# EAGLE schematic Electronica_4K1 (EAGLE 9.6.2)

## Sheet 1 of 5: Enemy sensors connectors
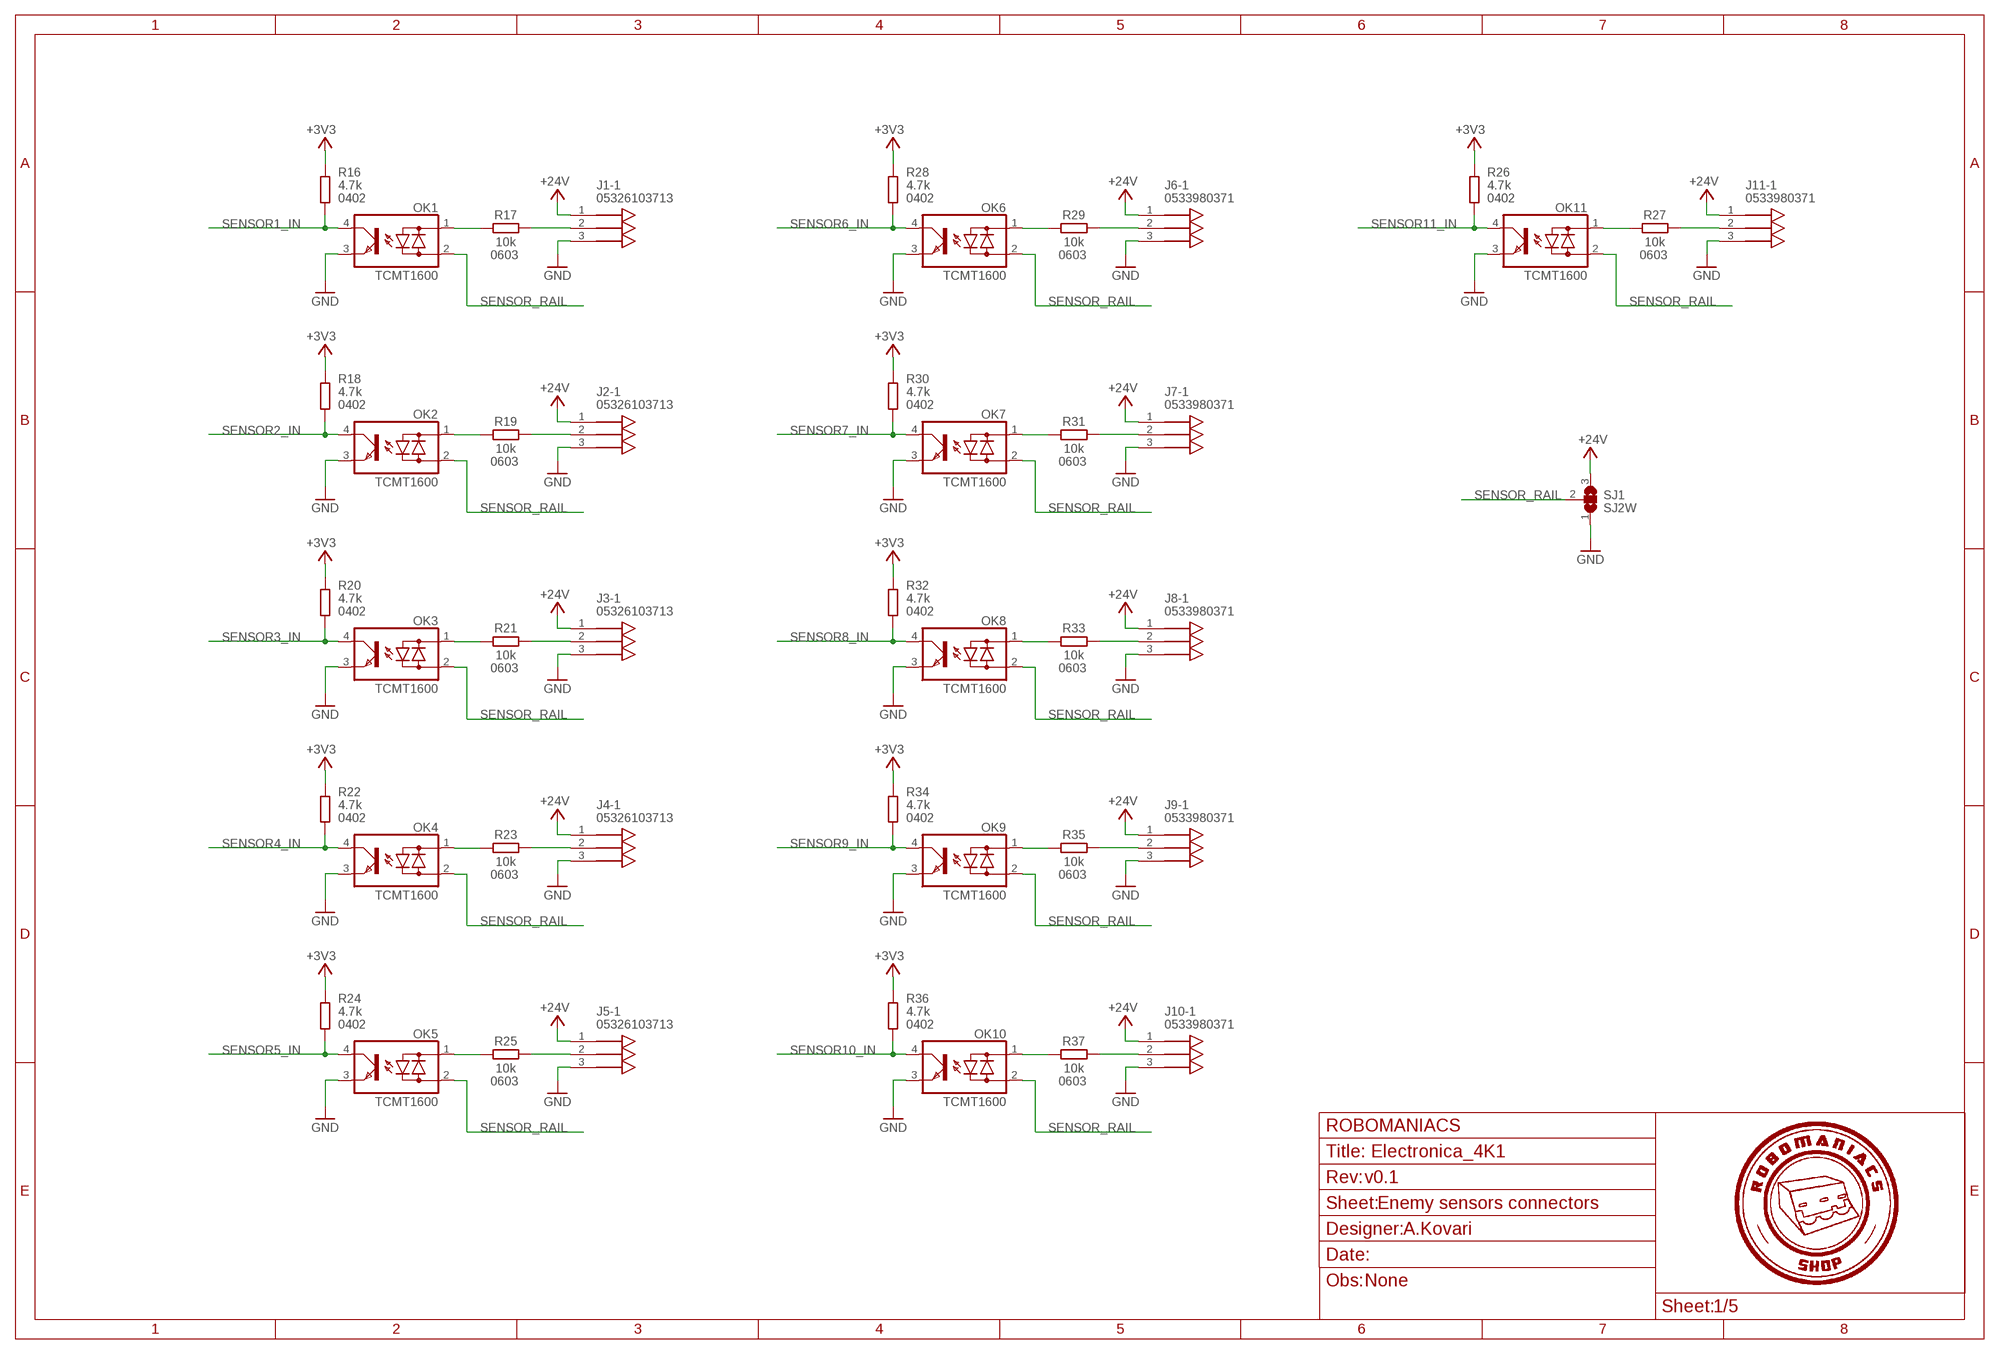
[diagram p0: schematic, sheet 1]
FRAME4 (_SCH_FRAME_A3): DNAME: A.Kovari; OBS: None; REVNUM: v0.1

### Parts
J1  05326103713  [PICOBLADE53261-0371]
J2  05326103713  [PICOBLADE53261-0371]
J3  05326103713  [PICOBLADE53261-0371]
J4  05326103713  [PICOBLADE53261-0371]
J5  05326103713  [PICOBLADE53261-0371]
J6  0533980371  [PICOBLADE53398-0571]
J7  0533980371  [PICOBLADE53398-0571]
J8  0533980371  [PICOBLADE53398-0571]
J9  0533980371  [PICOBLADE53398-0571]
J10  0533980371  [PICOBLADE53398-0571]
J11  0533980371  [PICOBLADE53398-0571]
OK1  TCMT1600  [SOP-4]
OK2  TCMT1600  [SOP-4]
OK3  TCMT1600  [SOP-4]
OK4  TCMT1600  [SOP-4]
OK5  TCMT1600  [SOP-4]
OK6  TCMT1600  [SOP-4]
OK7  TCMT1600  [SOP-4]
OK8  TCMT1600  [SOP-4]
OK9  TCMT1600  [SOP-4]
OK10  TCMT1600  [SOP-4]
OK11  TCMT1600  [SOP-4]
R16  4.7k  R0402  [R0402_IPC]
R17  10k  R-EU_R0603  [R0603]
R18  4.7k  R0402  [R0402_IPC]
R19  10k  R-EU_R0603  [R0603]
R20  4.7k  R0402  [R0402_IPC]
R21  10k  R-EU_R0603  [R0603]
R22  4.7k  R0402  [R0402_IPC]
R23  10k  R-EU_R0603  [R0603]
R24  4.7k  R0402  [R0402_IPC]
R25  10k  R-EU_R0603  [R0603]
R26  4.7k  R0402  [R0402_IPC]
R27  10k  R-EU_R0603  [R0603]
R28  4.7k  R0402  [R0402_IPC]
R29  10k  R-EU_R0603  [R0603]
R30  4.7k  R0402  [R0402_IPC]
R31  10k  R-EU_R0603  [R0603]
R32  4.7k  R0402  [R0402_IPC]
R33  10k  R-EU_R0603  [R0603]
R34  4.7k  R0402  [R0402_IPC]
R35  10k  R-EU_R0603  [R0603]
R36  4.7k  R0402  [R0402_IPC]
R37  10k  R-EU_R0603  [R0603]
SJ1  SJ2W  [SJ2W_1X1.5_NO]

### Nets
+3V3: R16.1 R18.1 R20.1 R22.1 R24.1 R26.1 R28.1 R30.1 R32.1 R34.1 R36.1 ; also sheet 2,4,5
+24V: J1.1 J2.1 J3.1 J4.1 J5.1 J6.1 J7.1 J8.1 J9.1 J10.1 J11.1 SJ1.3 ; also sheet 3,4,5
GND: J1.3 J2.3 J3.3 J4.3 J5.3 J6.3 J7.3 J8.3 J9.3 J10.3 J11.3 OK1.3(E) OK2.3(E) OK3.3(E) OK4.3(E) OK5.3(E) OK6.3(E) OK7.3(E) OK8.3(E) OK9.3(E) OK10.3(E) OK11.3(E) SJ1.1 ; also sheet 2,3,4,5
N$25: J1.2 R17.2
N$26: J2.2 R19.2
N$27: OK1.1(AC1) R17.1
N$28: OK2.1(AC1) R19.1
N$29: J3.2 R21.2
N$30: OK3.1(AC1) R21.1
N$31: J4.2 R23.2
N$32: OK4.1(AC1) R23.1
N$33: J5.2 R25.2
N$34: OK5.1(AC1) R25.1
N$35: J11.2 R27.2
N$36: OK11.1(AC1) R27.1
N$37: J6.2 R29.2
N$38: OK6.1(AC1) R29.1
N$39: J7.2 R31.2
N$40: OK7.1(AC1) R31.1
N$41: J8.2 R33.2
N$42: OK8.1(AC1) R33.1
N$43: J9.2 R35.2
N$44: OK9.1(AC1) R35.1
N$45: J10.2 R37.2
N$46: OK10.1(AC1) R37.1
SENSOR1_IN: OK1.4(C) R16.2 ; also sheet 5
SENSOR2_IN: OK2.4(C) R18.2 ; also sheet 5
SENSOR3_IN: OK3.4(C) R20.2 ; also sheet 5
SENSOR4_IN: OK4.4(C) R22.2 ; also sheet 5
SENSOR5_IN: OK5.4(C) R24.2 ; also sheet 5
SENSOR6_IN: OK6.4(C) R28.2 ; also sheet 5
SENSOR7_IN: OK7.4(C) R30.2 ; also sheet 5
SENSOR8_IN: OK8.4(C) R32.2 ; also sheet 5
SENSOR9_IN: OK9.4(C) R34.2 ; also sheet 5
SENSOR10_IN: OK10.4(C) R36.2 ; also sheet 5
SENSOR11_IN: OK11.4(C) R26.2 ; also sheet 5
SENSOR_RAIL: OK1.2(AC2) OK2.2(AC2) OK3.2(AC2) OK4.2(AC2) OK5.2(AC2) OK6.2(AC2) OK7.2(AC2) OK8.2(AC2) OK9.2(AC2) OK10.2(AC2) OK11.2(AC2) SJ1.2

## Sheet 2 of 5: Line sensors connectors
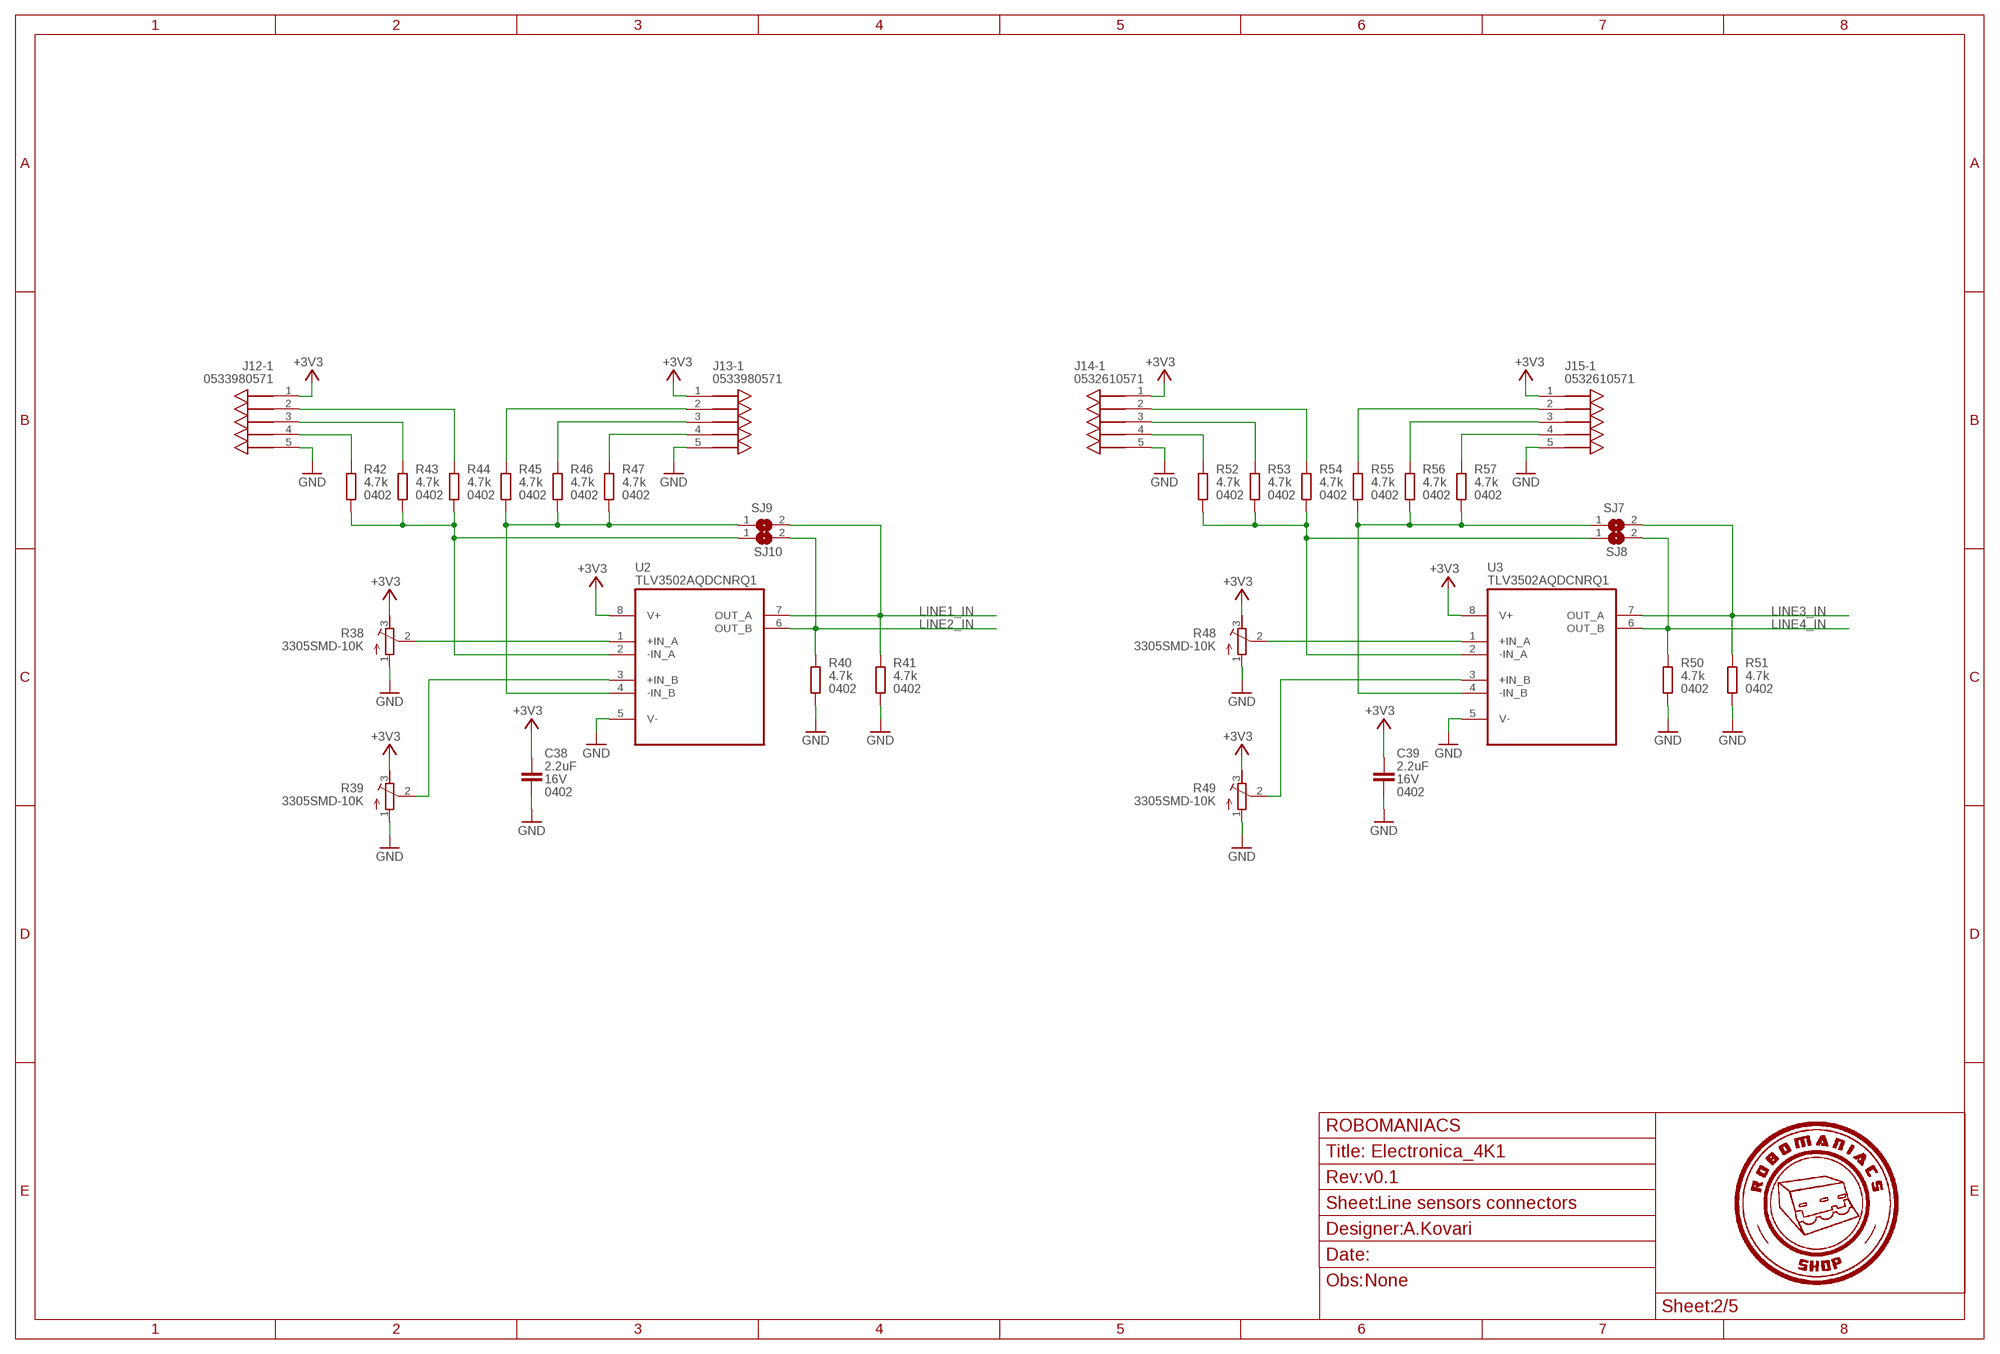
[diagram p1: schematic, sheet 2]
FRAME5 (_SCH_FRAME_A3): DNAME: A.Kovari; OBS: None; REVNUM: v0.1

### Parts
C38  2.2uF  C0402  [C0402_IPC]
C39  2.2uF  C0402  [C0402_IPC]
J12  0533980571  [PICOBLADE53398-0571]
J13  0533980571  [PICOBLADE53398-0571]
J14  0532610571  [PICOBLADE53261-0571]
J15  0532610571  [PICOBLADE53261-0571]
R38  3305SMD-10K  R-TRIMM3103  [RTRIM3103]
R39  3305SMD-10K  R-TRIMM3103  [RTRIM3103]
R40  4.7k  R0402  [R0402_IPC]
R41  4.7k  R0402  [R0402_IPC]
R42  4.7k  R0402  [R0402_IPC]
R43  4.7k  R0402  [R0402_IPC]
R44  4.7k  R0402  [R0402_IPC]
R45  4.7k  R0402  [R0402_IPC]
R46  4.7k  R0402  [R0402_IPC]
R47  4.7k  R0402  [R0402_IPC]
R48  3305SMD-10K  R-TRIMM3103  [RTRIM3103]
R49  3305SMD-10K  R-TRIMM3103  [RTRIM3103]
R50  4.7k  R0402  [R0402_IPC]
R51  4.7k  R0402  [R0402_IPC]
R52  4.7k  R0402  [R0402_IPC]
R53  4.7k  R0402  [R0402_IPC]
R54  4.7k  R0402  [R0402_IPC]
R55  4.7k  R0402  [R0402_IPC]
R56  4.7k  R0402  [R0402_IPC]
R57  4.7k  R0402  [R0402_IPC]
SJ7  SJ_1.5X1_NO  [SJ_1X1.5_NO]
SJ8  SJ_1.5X1_NO  [SJ_1X1.5_NO]
SJ9  SJ_1.5X1_NO  [SJ_1X1.5_NO]
SJ10  SJ_1.5X1_NO  [SJ_1X1.5_NO]
U2  TLV3502AQDCNRQ1  [SOT65P280X145-8N]
U3  TLV3502AQDCNRQ1  [SOT65P280X145-8N]

### Nets
+3V3: C38.1 C39.1 J12.1 J13.1 J14.1 J15.1 R38.3(E) R39.3(E) R48.3(E) R49.3(E) U2.8(V+) U3.8(V+) ; also sheet 1,4,5
GND: C38.2 C39.2 J12.5 J13.5 J14.5 J15.5 R38.1(A) R39.1(A) R40.2 R41.2 R48.1(A) R49.1(A) R50.2 R51.2 U2.5(V-) U3.5(V-) ; also sheet 1,3,4,5
LINE1_IN: R41.1 SJ9.2 U2.7(OUT_A) ; also sheet 5
LINE2_IN: R40.1 SJ10.2 U2.6(OUT_B) ; also sheet 5
LINE3_IN: R51.1 SJ7.2 U3.7(OUT_A) ; also sheet 5
LINE4_IN: R50.1 SJ8.2 U3.6(OUT_B) ; also sheet 5
N$47: R38.2(S) U2.1(+IN_A)
N$48: R39.2(S) U2.3(+IN_B)
N$49: R42.2 R43.2 R44.2 SJ10.1 U2.2(-IN_A)
N$50: R45.2 R46.2 R47.2 SJ9.1 U2.4(-IN_B)
N$51: J13.4 R47.1
N$52: J13.3 R46.1
N$53: J12.4 R42.1
N$54: J12.3 R43.1
N$55: J12.2 R44.1
N$56: J13.2 R45.1
N$57: R48.2(S) U3.1(+IN_A)
N$58: R49.2(S) U3.3(+IN_B)
N$59: R52.2 R53.2 R54.2 SJ8.1 U3.2(-IN_A)
N$60: R55.2 R56.2 R57.2 SJ7.1 U3.4(-IN_B)
N$61: J14.4 R52.1
N$62: J14.3 R53.1
N$63: J14.2 R54.1
N$64: J15.4 R57.1
N$65: J15.3 R56.1
N$66: J15.2 R55.1

## Sheet 3 of 5: +24V and +5V PSU
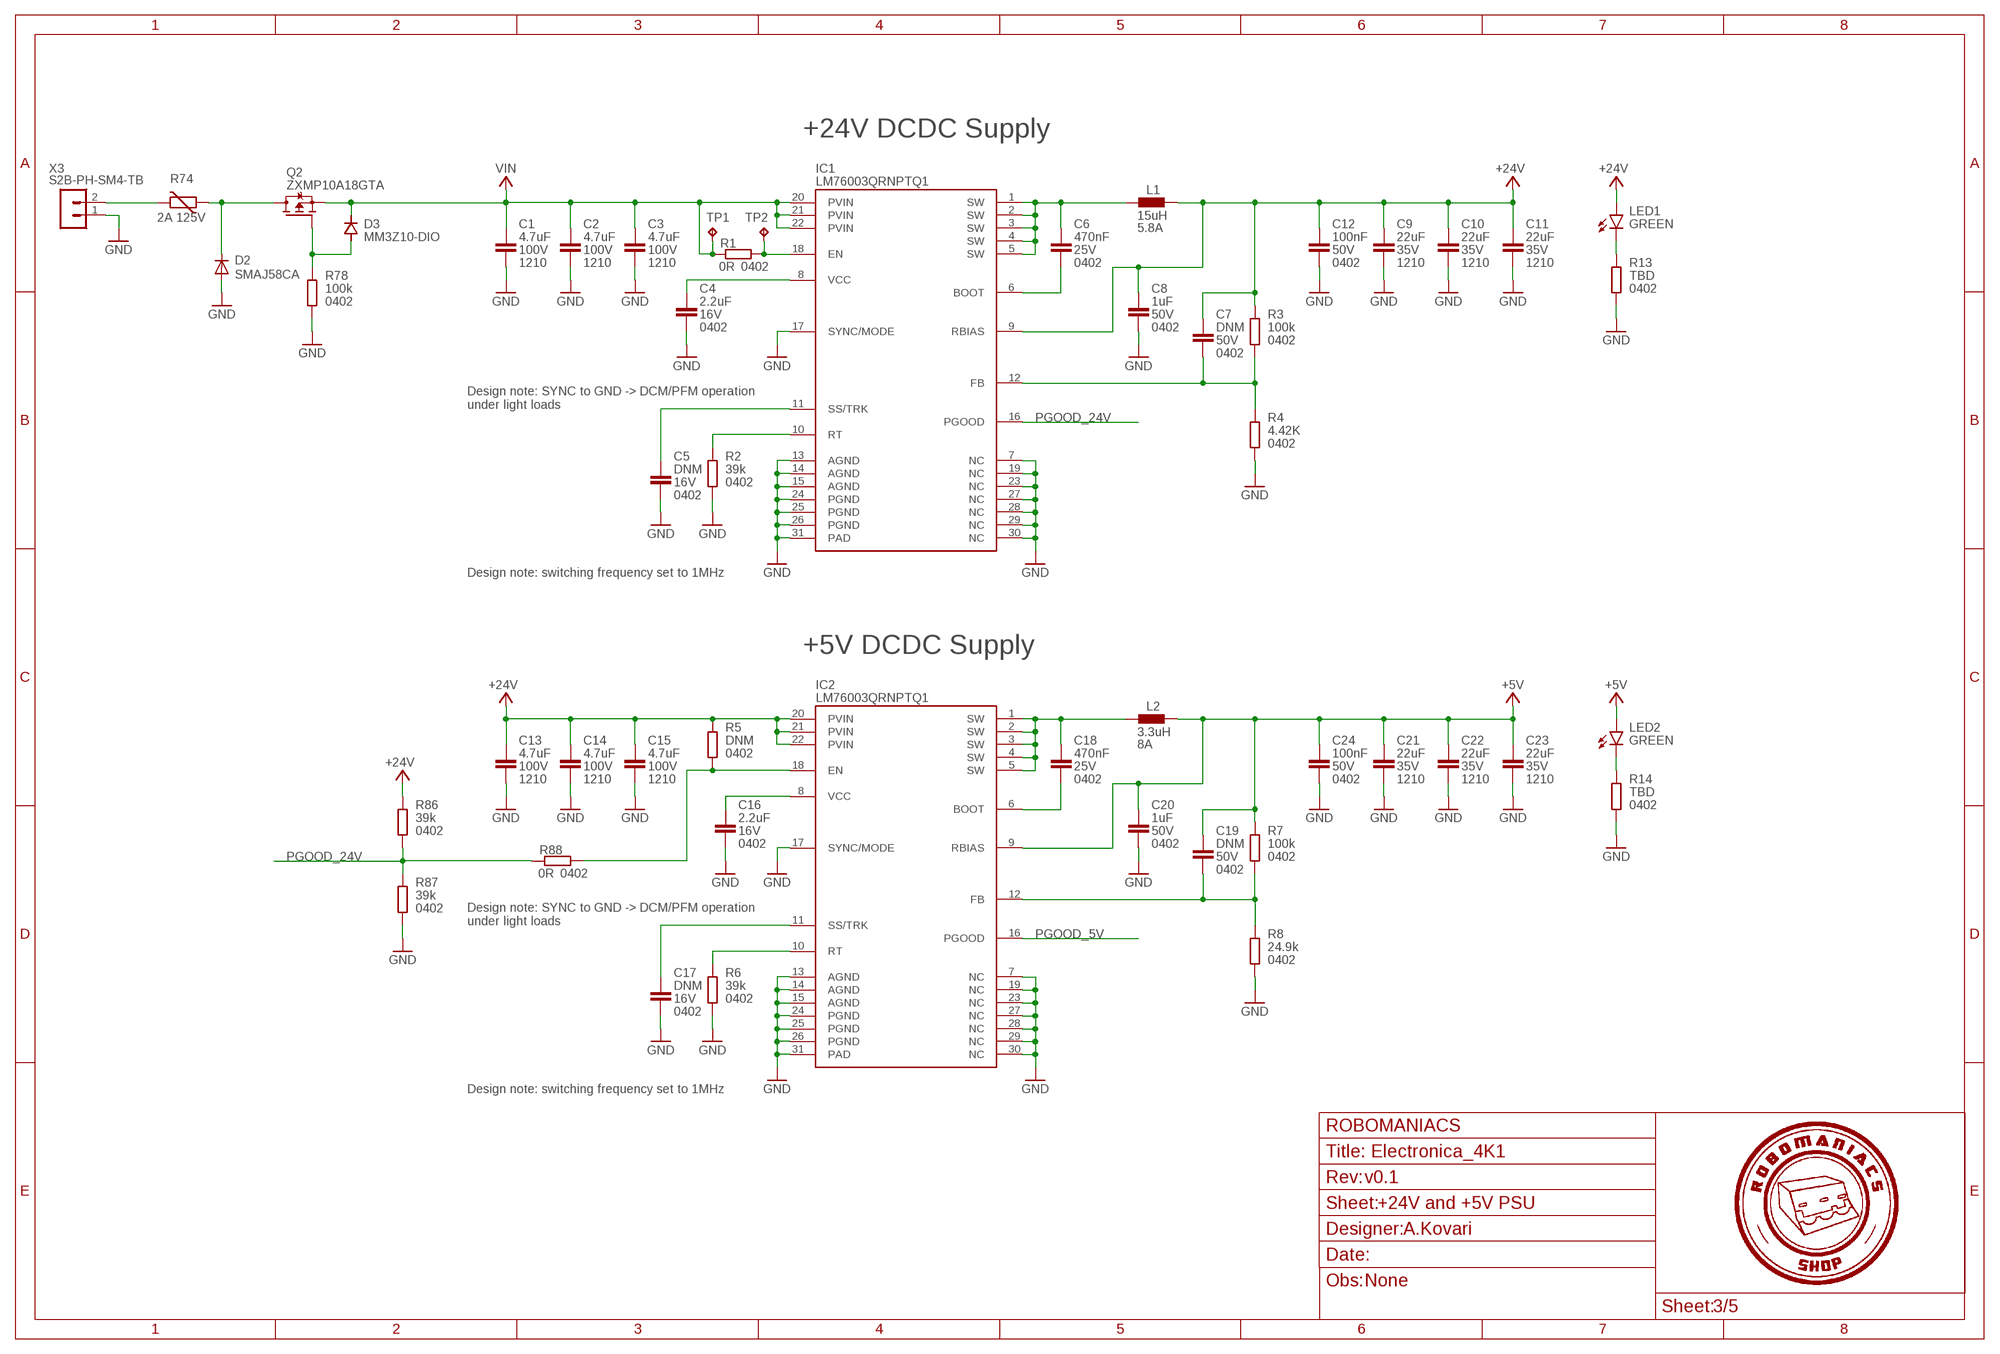
[diagram p2: schematic, sheet 3]
FRAME1 (_SCH_FRAME_A3): DNAME: A.Kovari; OBS: None; REVNUM: v0.1

### Parts
C1  4.7uF  C1210  [C1210]
C2  4.7uF  C1210  [C1210]
C3  4.7uF  C1210  [C1210]
C4  2.2uF  C0402  [C0402_IPC]
C5  DNM  C0402  [C0402_IPC]
C6  470nF  C0402  [C0402_IPC]
C7  DNM  C0402  [C0402_IPC]
C8  1uF  C0402  [C0402_IPC]
C9  22uF  C1210  [C1210]
C10  22uF  C1210  [C1210]
C11  22uF  C1210  [C1210]
C12  100nF  C0402  [C0402_IPC]
C13  4.7uF  C1210  [C1210]
C14  4.7uF  C1210  [C1210]
C15  4.7uF  C1210  [C1210]
C16  2.2uF  C0402  [C0402_IPC]
C17  DNM  C0402  [C0402_IPC]
C18  470nF  C0402  [C0402_IPC]
C19  DNM  C0402  [C0402_IPC]
C20  1uF  C0402  [C0402_IPC]
C21  22uF  C1210  [C1210]
C22  22uF  C1210  [C1210]
C23  22uF  C1210  [C1210]
C24  100nF  C0402  [C0402_IPC]
D2  SMAJ58CA  SMAJ33A  [SMA]
D3  MM3Z10-DIO  DSOD323  [SOD323]
IC1  LM76003QRNPTQ1  [WQFN30_6X4MM]
IC2  LM76003QRNPTQ1  [WQFN30_6X4MM]
L1  15uH  XAL6060  [XAL6060]
L2  3.3uH  XAL6060  [XAL6060]
LED1  GREEN  LED0603  [CHIPLED_0603]
LED2  GREEN  LED0603  [CHIPLED_0603]
Q2  ZXMP10A18GTA  BSP170P  [SOT223]
R1  0R  R0402  [R0402_IPC]
R2  39k  R0402  [R0402_IPC]
R3  100k  R0402  [R0402_IPC]
R4  4.42K  R0402  [R0402_IPC]
R5  DNM  R0402  [R0402_IPC]
R6  39k  R0402  [R0402_IPC]
R7  100k  R0402  [R0402_IPC]
R8  24.9k  R0402  [R0402_IPC]
R13  TBD  R0402  [R0402_IPC]
R14  TBD  R0402  [R0402_IPC]
R74  2A 125V  VARISTORCN1206  [CT/CN1206]
R78  100k  R0402  [R0402_IPC]
R86  39k  R0402  [R0402_IPC]
R87  39k  R0402  [R0402_IPC]
R88  0R  R0402  [R0402_IPC]
TP1  TPTP20SQ  [TP20SQ]
TP2  TPTP20SQ  [TP20SQ]
X3  S2B-PH-SM4-TB  [S2B-PH-SM4-TB]

### Nets
+5V: C19.1 C20.1 C21.1 C22.1 C23.1 C24.1 IC2.9(RBIAS) L2.2 LED2.A R7.2 ; also sheet 5
+24V: C7.1 C8.1 C9.1 C10.1 C11.1 C12.1 C13.1 C14.1 C15.1 IC1.9(RBIAS) IC2.20(PVIN) IC2.21(PVIN) IC2.22(PVIN) L1.2 LED1.A R3.2 R5.1 R86.2 ; also sheet 1,4,5
GND: C1.2 C2.2 C3.2 C4.2 C5.2 C8.2 C9.2 C10.2 C11.2 C12.2 C13.2 C14.2 C15.2 C16.2 C17.2 C20.2 C21.2 C22.2 C23.2 C24.2 D2.A IC1.7(NC) IC1.13(AGND) IC1.14(AGND) IC1.15(AGND) IC1.17(SYNC/MODE) IC1.19(NC) IC1.23(NC) IC1.24(PGND) IC1.25(PGND) IC1.26(PGND) IC1.27(NC) IC1.28(NC) IC1.29(NC) IC1.30(NC) IC1.31(PAD) IC2.7(NC) IC2.13(AGND) IC2.14(AGND) IC2.15(AGND) IC2.17(SYNC/MODE) IC2.19(NC) IC2.23(NC) IC2.24(PGND) IC2.25(PGND) IC2.26(PGND) IC2.27(NC) IC2.28(NC) IC2.29(NC) IC2.30(NC) IC2.31(PAD) R2.1 R4.1 R6.1 R8.1 R13.1 R14.1 R78.1 R87.1 X3.1 ; also sheet 1,2,4,5
N$1: C4.1 IC1.8(VCC)
N$3: IC1.18(EN) R1.2 TP2.TP
N$4: IC1.10(RT) R2.2
N$5: C7.2 IC1.12(FB) R3.1 R4.2
N$6: C5.1 IC1.11(SS/TRK)
N$7: C16.1 IC2.8(VCC)
N$8: C6.1 IC1.1(SW) IC1.2(SW) IC1.3(SW) IC1.4(SW) IC1.5(SW) L1.1
N$9: C6.2 IC1.6(BOOT)
N$10: C17.1 IC2.11(SS/TRK)
N$11: IC2.10(RT) R6.2
N$12: C18.1 IC2.1(SW) IC2.2(SW) IC2.3(SW) IC2.4(SW) IC2.5(SW) L2.1
N$13: C18.2 IC2.6(BOOT)
N$14: C19.2 IC2.12(FB) R7.1 R8.2
N$22: LED1.C R13.2
N$23: LED2.C R14.2
N$82: D3.2(A) Q2.1(G) R78.2
N$83: D2.C Q2.2(D) Q2.4(D) R74.1
N$85: R74.2 X3.2
N$90: IC2.18(EN) R5.2 R88.2
PGOOD_5V: IC2.16(PGOOD)
PGOOD_24V: IC1.16(PGOOD) R86.1 R87.2 R88.1 ; also sheet 4
VIN: C1.1 C2.1 C3.1 D3.1(C) IC1.20(PVIN) IC1.21(PVIN) IC1.22(PVIN) Q2.3(S) R1.1 TP1.TP

### Notes on the sheet
- +24V DCDC Supply
- Design note: SYNC to GND -> DCM/PFM operation 
  under light loads
- Design note: switching frequency set to 1MHz
- +5V DCDC Supply
- Design note: SYNC to GND -> DCM/PFM operation 
  under light loads
- Design note: switching frequency set to 1MHz

## Sheet 4 of 5: +3.3V PSU
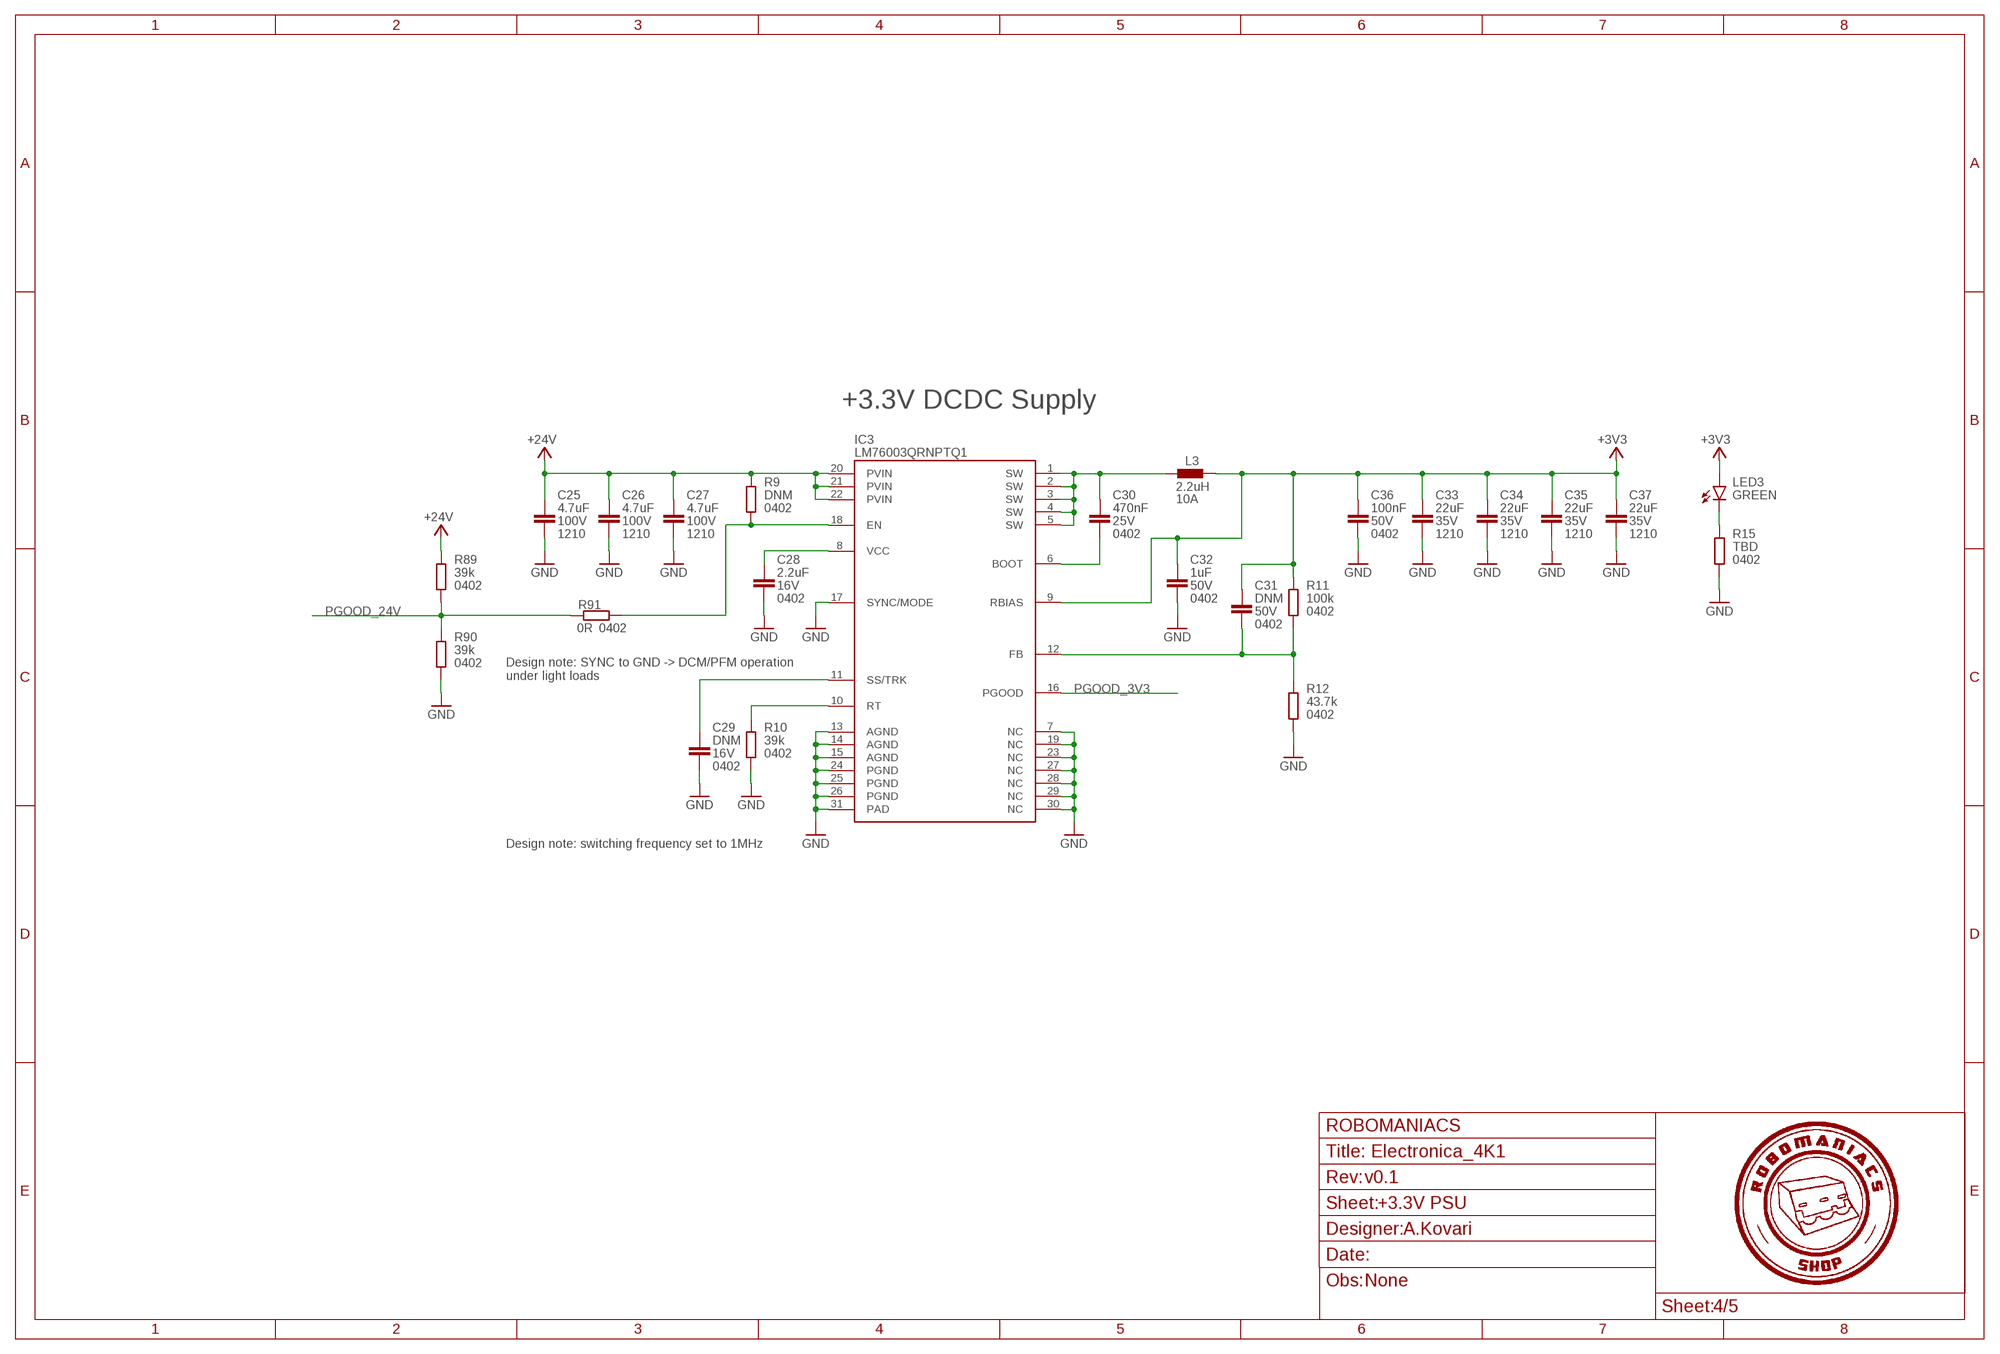
[diagram p3: schematic, sheet 4]
FRAME2 (_SCH_FRAME_A3): DNAME: A.Kovari; OBS: None; REVNUM: v0.1

### Parts
C25  4.7uF  C1210  [C1210]
C26  4.7uF  C1210  [C1210]
C27  4.7uF  C1210  [C1210]
C28  2.2uF  C0402  [C0402_IPC]
C29  DNM  C0402  [C0402_IPC]
C30  470nF  C0402  [C0402_IPC]
C31  DNM  C0402  [C0402_IPC]
C32  1uF  C0402  [C0402_IPC]
C33  22uF  C1210  [C1210]
C34  22uF  C1210  [C1210]
C35  22uF  C1210  [C1210]
C36  100nF  C0402  [C0402_IPC]
C37  22uF  C1210  [C1210]
IC3  LM76003QRNPTQ1  [WQFN30_6X4MM]
L3  2.2uH  XAL6060  [XAL6060]
LED3  GREEN  LED0603  [CHIPLED_0603]
R9  DNM  R0402  [R0402_IPC]
R10  39k  R0402  [R0402_IPC]
R11  100k  R0402  [R0402_IPC]
R12  43.7k  R0402  [R0402_IPC]
R15  TBD  R0402  [R0402_IPC]
R89  39k  R0402  [R0402_IPC]
R90  39k  R0402  [R0402_IPC]
R91  0R  R0402  [R0402_IPC]

### Nets
+3V3: C31.1 C32.1 C33.1 C34.1 C35.1 C36.1 C37.1 IC3.9(RBIAS) L3.2 LED3.A R11.2 ; also sheet 1,2,5
+24V: C25.1 C26.1 C27.1 IC3.20(PVIN) IC3.21(PVIN) IC3.22(PVIN) R9.1 R89.2 ; also sheet 1,3,5
GND: C25.2 C26.2 C27.2 C28.2 C29.2 C32.2 C33.2 C34.2 C35.2 C36.2 C37.2 IC3.7(NC) IC3.13(AGND) IC3.14(AGND) IC3.15(AGND) IC3.17(SYNC/MODE) IC3.19(NC) IC3.23(NC) IC3.24(PGND) IC3.25(PGND) IC3.26(PGND) IC3.27(NC) IC3.28(NC) IC3.29(NC) IC3.30(NC) IC3.31(PAD) R10.1 R12.1 R15.1 R90.1 ; also sheet 1,2,3,5
N$2: IC3.18(EN) R9.2 R91.2
N$16: C28.1 IC3.8(VCC)
N$17: C29.1 IC3.11(SS/TRK)
N$18: IC3.10(RT) R10.2
N$19: C30.1 IC3.1(SW) IC3.2(SW) IC3.3(SW) IC3.4(SW) IC3.5(SW) L3.1
N$20: C30.2 IC3.6(BOOT)
N$21: C31.2 IC3.12(FB) R11.1 R12.2
N$24: LED3.C R15.2
PGOOD_3V3: IC3.16(PGOOD)
PGOOD_24V: R89.1 R90.2 R91.1 ; also sheet 3

### Notes on the sheet
- +3.3V DCDC Supply
- Design note: SYNC to GND -> DCM/PFM operation 
  under light loads
- Design note: switching frequency set to 1MHz

## Sheet 5 of 5: Teensy and controls
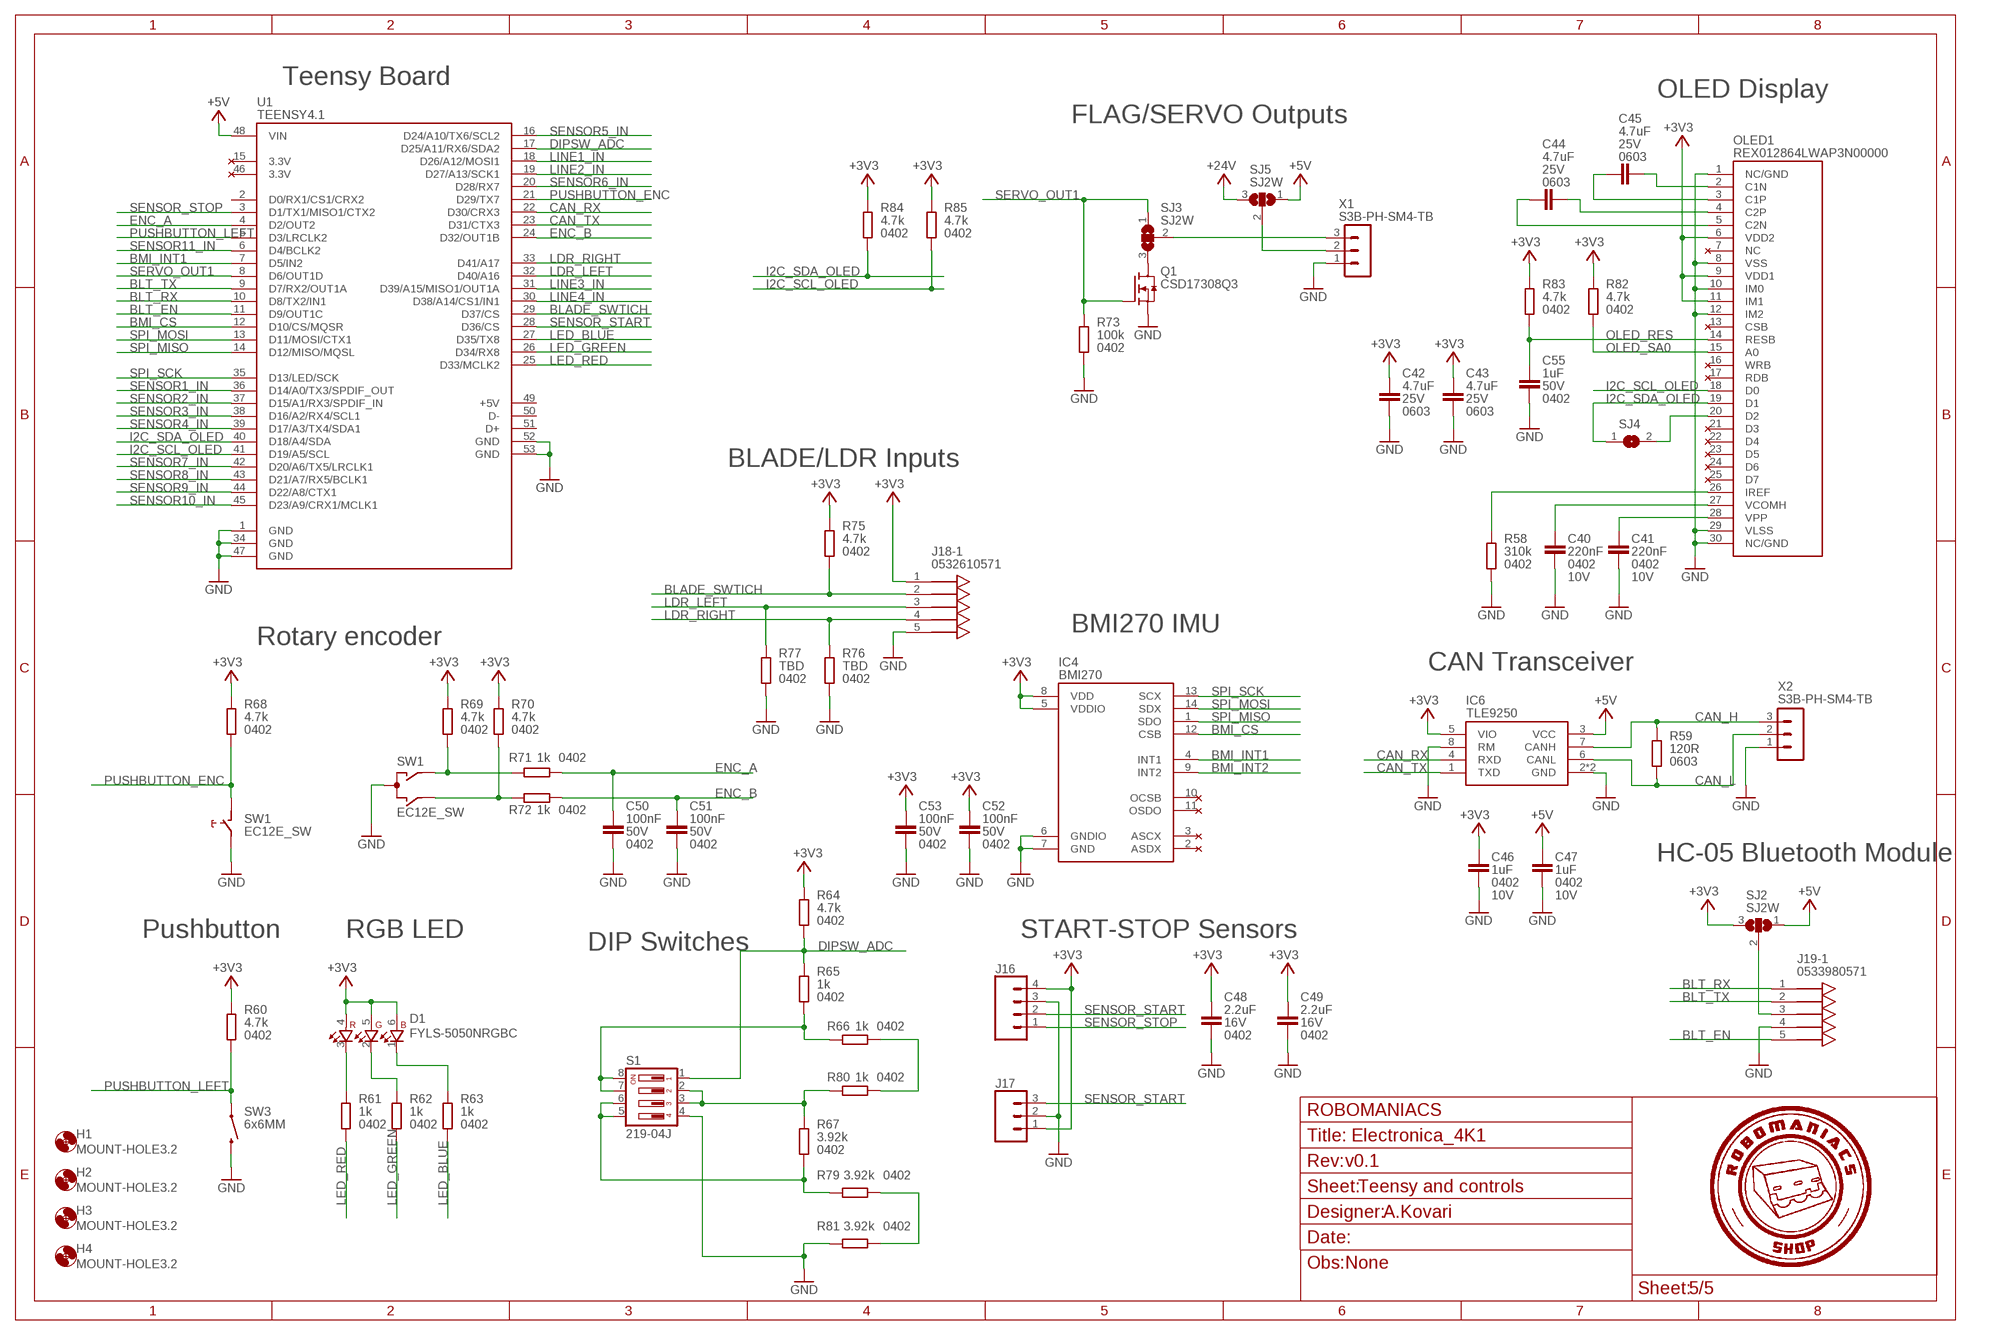
[diagram p4: schematic, sheet 5]
FRAME3 (_SCH_FRAME_A3): DNAME: A.Kovari; OBS: None; REVNUM: v0.1

### Parts
C40  220nF  C0402  [C0402_IPC]
C41  220nF  C0402  [C0402_IPC]
C42  4.7uF  C0603  [C0603]
C43  4.7uF  C0603  [C0603]
C44  4.7uF  C0603  [C0603]
C45  4.7uF  C0603  [C0603]
C46  1uF  C0402  [C0402_IPC]
C47  1uF  C0402  [C0402_IPC]
C48  2.2uF  C0402  [C0402_IPC]
C49  2.2uF  C0402  [C0402_IPC]
C50  100nF  C0402  [C0402_IPC]
C51  100nF  C0402  [C0402_IPC]
C52  100nF  C0402  [C0402_IPC]
C53  100nF  C0402  [C0402_IPC]
C55  1uF  C0402  [C0402_IPC]
D1  FYLS-5050NRGBC  [FYLS-5050NRGBC]
H1  MOUNT-HOLE3.2  [3,2]
H2  MOUNT-HOLE3.2  [3,2]
H3  MOUNT-HOLE3.2  [3,2]
H4  MOUNT-HOLE3.2  [3,2]
IC4  BMI270  [LGA_BMI270]
IC6  TLE9250  [PG-TSON-8]
J16  CONN_04  [1X04]
J17  CONN_03  [1X03]
J18  0532610571  [PICOBLADE53261-0571]
J19  0533980571  [PICOBLADE53398-0571]
OLED1  REX012864LWAP3N00000  [REX012864LWAP3N00000]
Q1  CSD17308Q3  [VSON-3X3]
R58  310k  R0402  [R0402_IPC]
R59  120R  R-EU_R0603  [R0603]
R60  4.7k  R0402  [R0402_IPC]
R61  1k  R0402  [R0402_IPC]
R62  1k  R0402  [R0402_IPC]
R63  1k  R0402  [R0402_IPC]
R64  4.7k  R0402  [R0402_IPC]
R65  1k  R0402  [R0402_IPC]
R66  1k  R0402  [R0402_IPC]
R67  3.92k  R0402  [R0402_IPC]
R68  4.7k  R0402  [R0402_IPC]
R69  4.7k  R0402  [R0402_IPC]
R70  4.7k  R0402  [R0402_IPC]
R71  1k  R0402  [R0402_IPC]
R72  1k  R0402  [R0402_IPC]
R73  100k  R0402  [R0402_IPC]
R75  4.7k  R0402  [R0402_IPC]
R76  TBD  R0402  [R0402_IPC]
R77  TBD  R0402  [R0402_IPC]
R79  3.92k  R0402  [R0402_IPC]
R80  1k  R0402  [R0402_IPC]
R81  3.92k  R0402  [R0402_IPC]
R82  4.7k  R0402  [R0402_IPC]
R83  4.7k  R0402  [R0402_IPC]
R84  4.7k  R0402  [R0402_IPC]
R85  4.7k  R0402  [R0402_IPC]
S1  219-04J  [CTS-219-04J]
SJ2  SJ2W  [SJ2W_1X1.5_NO]
SJ3  SJ2W  [SJ2W_1X1.5_NO]
SJ4  SJ_1.5X1_NO  [SJ_1X1.5_NO]
SJ5  SJ2W  [SJ2W_1X1.5_NO]
SW1  EC12E_SW  [ALPS_EC12E_SW]
SW3  6x6MM  MOMENTARY-SWITCH-SPST-SMD-6.2MM-TALL  [TACTILE_SWITCH_SMD_6.2MM_TALL]
U1  TEENSY4.1  [TEENSY4.1]
X1  S3B-PH-SM4-TB  [S3B-PH-SM4-TB]
X2  S3B-PH-SM4-TB  [S3B-PH-SM4-TB]

### Nets
+3V3: C42.1 C43.1 C46.1 C48.1 C49.1 C52.1 C53.1 D1.4(RED_A) D1.5(GREEN_A) D1.6(BLUE_A) IC4.5(VDDIO) IC4.8(VDD) IC6.5(VIO) J16.4 J17.1 J18.1 OLED1.6(VDD2) OLED1.9(VDD1) OLED1.11(IM1) R60.1 R64.1 R68.1 R69.1 R70.1 R75.1 R82.1 R83.1 R84.1 R85.1 SJ2.3 ; also sheet 1,2,4
+5V: C47.1 IC6.3(VCC) SJ2.1 SJ5.1 U1.48(VIN) ; also sheet 3
+24V: SJ5.3 ; also sheet 1,3,4
BLADE_SWTICH: J18.2 R75.2 U1.29(D37/CS)
BLT_EN: J19.5 U1.11(D9/OUT1C)
BLT_RX: J19.1 U1.10(D8/TX2/IN1)
BLT_TX: J19.2 U1.9(D7/RX2/OUT1A)
BMI_CS: IC4.12(CSB) U1.12(D10/CS/MQSR)
BMI_INT1: IC4.4(INT1) U1.7(D5/IN2)
BMI_INT2: IC4.9(INT2)
CAN_H [100R_DIFF]: IC6.7(CANH) R59.2 X2.3
CAN_L [100R_DIFF]: IC6.6(CANL) R59.1 X2.2
CAN_RX: IC6.4(RXD) U1.22(D30/CRX3)
CAN_TX: IC6.1(TXD) U1.23(D31/CTX3)
DIPSW_ADC: R64.2 R65.1 S1.1 U1.17(D25/A11/RX6/SDA2)
ENC_A: C50.1 R71.1 U1.4(D2/OUT2)
ENC_B: C51.1 R72.1 U1.24(D32/OUT1B)
GND: C40.2 C41.2 C42.2 C43.2 C46.2 C47.2 C48.2 C49.2 C50.2 C51.2 C52.2 C53.2 C55.2 IC4.6(GNDIO) IC4.7(GND) IC6.2(GND) IC6.8(RM) IC6.EP(GND) J16.3 J17.2 J18.5 J19.4 OLED1.1(NC/GND) OLED1.8(VSS) OLED1.10(IM0) OLED1.12(IM2) OLED1.29(VLSS) OLED1.30(NC/GND) Q1.1(S) Q1.2(S) Q1.3(S) R58.1 R73.1 R76.1 R77.1 R81.1 S1.4 SW1.C SW1.E SW3.B2 U1.1(GND) U1.34(GND) U1.47(GND) U1.52(GND) U1.53(GND) X1.1 X2.1 ; also sheet 1,2,3,4
I2C_SCL_OLED: OLED1.18(D0) R85.2 U1.41(D19/A5/SCL)
I2C_SDA_OLED: OLED1.19(D1) R84.2 SJ4.1 U1.40(D18/A4/SDA)
LDR_LEFT: J18.3 R77.2 U1.32(D40/A16)
LDR_RIGHT: J18.4 R76.2 U1.33(D41/A17)
LED_BLUE: R63.1 U1.27(D35/TX8)
LED_GREEN: R62.1 U1.26(D34/RX8)
LED_RED: R61.1 U1.25(D33/MCLK2)
LINE1_IN: U1.18(D26/A12/MOSI1) ; also sheet 2
LINE2_IN: U1.19(D27/A13/SCK1) ; also sheet 2
LINE3_IN: U1.31(D39/A15/MISO1/OUT1A) ; also sheet 2
LINE4_IN: U1.30(D38/A14/CS1/IN1) ; also sheet 2
N$67: C45.2 OLED1.2(C1N)
N$68: C45.1 OLED1.3(C1P)
N$69: C44.2 OLED1.4(C2P)
N$70: C44.1 OLED1.5(C2N)
N$71: OLED1.26(IREF) R58.2
N$72: C40.1 OLED1.27(VCOMH)
N$73: C41.1 OLED1.28(VPP)
N$74: D1.3(RED_K) R61.2
N$75: D1.2(GREEN_K) R62.2
N$76: D1.1(BLUE_K) R63.2
N$77: R69.2 R71.2 SW1.A
N$78: R70.2 R72.2 SW1.B
N$79: J19.3 SJ2.2
N$80: SJ5.2 X1.2
N$81: SJ3.2 X1.3
N$84: Q1.5(D) Q1.6(D) Q1.7(D) Q1.8(D) SJ3.3
N$86: R65.2 R66.2 S1.7 S1.8
N$87: R79.2 R81.2
N$88: R66.1 R80.1
N$89: OLED1.20(D2) SJ4.2
N$91: R67.1 R80.2 S1.2 S1.3
N$92: R67.2 R79.1 S1.5 S1.6
OLED_RES: C55.1 OLED1.14(RESB) R83.2
OLED_SA0: OLED1.15(A0) R82.2
PUSHBUTTON_ENC: R68.2 SW1.D U1.21(D29/TX7)
PUSHBUTTON_LEFT: R60.2 SW3.A2 U1.5(D3/LRCLK2)
SENSOR1_IN: U1.36(D14/A0/TX3/SPDIF_OUT) ; also sheet 1
SENSOR2_IN: U1.37(D15/A1/RX3/SPDIF_IN) ; also sheet 1
SENSOR3_IN: U1.38(D16/A2/RX4/SCL1) ; also sheet 1
SENSOR4_IN: U1.39(D17/A3/TX4/SDA1) ; also sheet 1
SENSOR5_IN: U1.16(D24/A10/TX6/SCL2) ; also sheet 1
SENSOR6_IN: U1.20(D28/RX7) ; also sheet 1
SENSOR7_IN: U1.42(D20/A6/TX5/LRCLK1) ; also sheet 1
SENSOR8_IN: U1.43(D21/A7/RX5/BCLK1) ; also sheet 1
SENSOR9_IN: U1.44(D22/A8/CTX1) ; also sheet 1
SENSOR10_IN: U1.45(D23/A9/CRX1/MCLK1) ; also sheet 1
SENSOR11_IN: U1.6(D4/BCLK2) ; also sheet 1
SENSOR_START: J16.2 J17.3 U1.28(D36/CS)
SENSOR_STOP: J16.1 U1.3(D1/TX1/MISO1/CTX2)
SERVO_OUT1: Q1.4(G) R73.2 SJ3.1 U1.8(D6/OUT1D)
SPI_MISO: IC4.1(SDO) U1.14(D12/MISO/MQSL)
SPI_MOSI: IC4.14(SDX) U1.13(D11/MOSI/CTX1)
SPI_SCK: IC4.13(SCX) U1.35(D13/LED/SCK)
Unconnected: IC4.2(ASDX) IC4.3(ASCX) IC4.10(OCSB) IC4.11(OSDO) OLED1.7(NC) OLED1.13(CSB) OLED1.16(WRB) OLED1.17(RDB) OLED1.21(D3) OLED1.22(D4) OLED1.23(D5) OLED1.24(D6) OLED1.25(D7) SW1.GND1(G) SW1.GND2(G) U1.2(D0/RX1/CS1/CRX2) U1.15(3.3V) U1.46(3.3V) U1.49(+5V) U1.50(D-) U1.51(D+)

### Notes on the sheet
- Teensy Board
- OLED Display
- FLAG/SERVO Outputs
- BLADE/LDR Inputs
- BMI270 IMU
- Rotary encoder
- CAN Transceiver
- HC-05 Bluetooth Module
- Pushbutton | RGB LED | START-STOP Sensors
- DIP Switches

## Library data of the parts
C1-C3 C13-C15 C25-C27 = _nanolabs_rcl:C1210; MPN: CL32B475KCVZ3WE; PACKAGE: 1210; VOLTAGE: 100V
C4 C5 C16 C17 C28 C29 C38 C39 C48 C49 = _nanolabs_rcl:C0402; MPN: GRM155R61C225ME15D; PACKAGE: 0402; VOLTAGE: 16V
C6 C18 C30 = _nanolabs_rcl:C0402; MPN: GRM155R61E474KE01D; PACKAGE: 0402; VOLTAGE: 25V
C7 C19 C31 = _nanolabs_rcl:C0402; MPN: GRM155R61E474KE01D; PACKAGE: 0402; VOLTAGE: 50V
C8 C20 C32 C55 = _nanolabs_rcl:C0402; MPN: GRM155R61H105ME05D; PACKAGE: 0402; VOLTAGE: 50V
C9-C11 C21-C23 C33-C35 C37 = _nanolabs_rcl:C1210; MPN: GMK325BJ226MM-P; PACKAGE: 1210; VOLTAGE: 35V
C12 C24 C36 C50-C53 = _nanolabs_rcl:C0402; MPN: GRM155R71H104ME14D; PACKAGE: 0402; VOLTAGE: 50V
C40 C41 C46 C47 = _nanolabs_rcl:C0402; PACKAGE: 0402; VOLTAGE: 10V
C42-C45 = _nanolabs_rcl:C0603; PACKAGE: 0603; VOLTAGE: 25V
D1 = _nanolabs_diodes:FYLS-5050NRGBC
D2 = power:SMAJ: TVS DIODE 3.3W DO214AC
D3 = zetex:D: DIODE; MPN: CDSOD323-T05C; OC_FARNELL: 1824860; OC_NEWARK: 79R6078; URL: https://www.tme.eu/ro/details/mm3z10-dio/diode-zener-smd/diotec-semiconductor/mm3z10/
H1-H4 = holes:MOUNT-HOLE: MOUNTING HOLE with drill center marker
IC1-IC3 = _nanolabs_ic:LM76003QRNPTQ1
IC4 = _nanolabs_ic:BMI270
IC6 = _nanolabs_ic:TLE9250
J1-J5 = volks73-Molex:0532610371: 1.25mm Pitch PicoBlade™ Header, Surface Mount, Right Angle, 3 Circuits PicoBlade™ Connector System Documentation Drawing <http://www.molex.com/pdm_docs/sd/532610371_sd.pdf>
J6-J11 = _nanolabs_connectors:0533980371: 1.25mm Pitch PicoBlade™ Header, Surface Mount, Vertical, 3 Circuits PicoBlade™ Connector System Documentation Drawing <http://www.molex.com/pdm_docs/sd/533980571_sd.pdf>; CATEGORY: Connectors, Interconnects; COLOR: Natural; CONNECTOR_TYPE: Header, Shrouded; CONTACT_FINISH: Tin; CONTACT_FINISH_THICKNESS: 39µin (1.00µm); CONTACT_MATING_LENGTH: -; CONTACT_TYPE: Blade Pin; DESCRIPTION: CONN HEADER 5POS 1.25MM VERT SMD; DOCUMENTATION_LINK: <a href="http://www.molex.com/pdm_docs/sd/533980571_sd.pdf">Drawing</a>; DOCUMENTATION_URL: http://www.molex.com/pdm_docs/sd/533980571_sd.pdf; FAMILY: Rectangular Connectors - Headers, Male Pins; FASTENING_TYPE: -; FEATURES: Solder Retention; MANUFACTURER: Molex Inc; MOUNTING_TYPE: Surface Mount; NUMBER_OF_POSITIONS: 5; NUMBER_OF_POSITIONS_LOADED: All; NUMBER_OF_ROWS: 1; PART_NUMBER: 0533980571; PITCH: 0.049" (1.25mm); ROW_SPACING: -; SERIES: PicoBlade™ 53398; SUPPLIER_ITEM_LINK: <a href="http://www.digikey.com/product-detail/en/0533980571/WM7609CT-ND/699083">Details</a>; SUPPLIER_ITEM_NUMBER: WM7609CT-ND; SUPPLIER_ITEM_URL: http://www.digikey.com/product-detail/en/0533980571/WM7609CT-ND/699083; SUPPLIER_LINK: <a href="http://www.digikey.com">Home Page</a>; SUPPLIER_NAME: Digi-key; SUPPLIER_URL: http://www.digikey.com; TERMINATION: Solder
J12 J13 J19 = volks73-Molex:0533980571: 1.25mm Pitch PicoBlade™ Header, Surface Mount, Vertical, 5 Circuits PicoBlade™ Connector System Documentation Drawing <http://www.molex.com/pdm_docs/sd/533980571_sd.pdf>; CATEGORY: Connectors, Interconnects; COLOR: Natural; CONNECTOR_TYPE: Header, Shrouded; CONTACT_FINISH: Tin; CONTACT_FINISH_THICKNESS: 39µin (1.00µm); CONTACT_MATING_LENGTH: -; CONTACT_TYPE: Blade Pin; DESCRIPTION: CONN HEADER 5POS 1.25MM VERT SMD; DOCUMENTATION_LINK: <a href="http://www.molex.com/pdm_docs/sd/533980571_sd.pdf">Drawing</a>; DOCUMENTATION_URL: http://www.molex.com/pdm_docs/sd/533980571_sd.pdf; FAMILY: Rectangular Connectors - Headers, Male Pins; FASTENING_TYPE: -; FEATURES: Solder Retention; MANUFACTURER: Molex Inc; MOUNTING_TYPE: Surface Mount; NUMBER_OF_POSITIONS: 5; NUMBER_OF_POSITIONS_LOADED: All; NUMBER_OF_ROWS: 1; PART_NUMBER: 0533980571; PITCH: 0.049" (1.25mm); ROW_SPACING: -; SERIES: PicoBlade™ 53398; SUPPLIER_ITEM_LINK: <a href="http://www.digikey.com/product-detail/en/0533980571/WM7609CT-ND/699083">Details</a>; SUPPLIER_ITEM_NUMBER: WM7609CT-ND; SUPPLIER_ITEM_URL: http://www.digikey.com/product-detail/en/0533980571/WM7609CT-ND/699083; SUPPLIER_LINK: <a href="http://www.digikey.com">Home Page</a>; SUPPLIER_NAME: Digi-key; SUPPLIER_URL: http://www.digikey.com; TERMINATION: Solder
J14 J15 J18 = volks73-Molex:0532610571: 1.25mm Pitch PicoBlade™ Header, Surface Mount, Right Angle, 5 Circuits PicoBlade™ Connector System Documentation Drawing <http://www.molex.com/pdm_docs/sd/532610571_sd.pdf>; CATEGORY: Connectors, Interconnects; COLOR: Natural; CONNECTOR_TYPE: Header, Shrouded; CONTACT_FINISH: Tin; CONTACT_FINISH_THICKNESS: 39µin (1.00µm); CONTACT_MATING_LENGTH: -; CONTACT_TYPE: Blade Pin; DESCRIPTION: CONN HEADER 5POS 1.25MM R/A SMD; DOCUMENTATION_LINK: <a href="http://www.molex.com/pdm_docs/sd/532610571_sd.pdf">Datasheet</a>; DOCUMENTATION_URL: http://www.molex.com/pdm_docs/sd/532610571_sd.pdf; FAMILY: Rectangular Connectors - Headers, Male Pins; FASTENING_TYPE: -; FEATURES: Solder Retention; MANUFACTURER: Molex Inc; MOUNTING_TYPE: Surface Mount, Right Angle; NUMBER_OF_POSITIONS: 5; NUMBER_OF_POSITIONS_LOADED: All; NUMBER_OF_ROWS: 1; PART_NUMBER: 0532610571; PITCH: 0.049" (1.25mm); ROW_SPACING: -; SERIES: PicoBlade™ 53261; SUPPLIER_ITEM_LINK: <a href="http://www.digikey.com/product-detail/en/0532610571/WM7623CT-ND/699110">Details</a>; SUPPLIER_ITEM_NUMBER: WM7623CT-ND; SUPPLIER_ITEM_URL: http://www.digikey.com/product-detail/en/0532610571/WM7623CT-ND/699110; SUPPLIER_LINK: <a href="http://www.digikey.com">Home Page</a>; SUPPLIER_NAME: Digi-Key; SUPPLIER_URL: http://www.digikey.com; TERMINATION: Solder
J16 = SparkFun-Connectors:CONN_04: Multi connection point. Often used as Generic Header-pin footprint for 0.1 inch spaced/style header connections On any of the 0.1 inch spaced packages, you can populate with these: Break Away Headers - Straight <https://www.sparkfun.com/products/116> (PRT-00116) Break Away Male Headers - Right Angle <https://www.sparkfun.com/products/553> (PRT-00553) Female Headers <https://www.sparkfun.com/products/115> (PRT-00115) Break Away Headers - Machine Pin <https://www.sparkfun.com/products/117> (PRT-00117) Break Away Female Headers - Swiss Machine Pin <https://www.sparkfun.com/products/743> (PRT-00743) For SCREWTERMINALS and SPRING TERMINALS visit here: Screw Terimnals on SparkFun.com <https://www.sparkfun.com/search/results?term=Screw+Terminals> (5mm/3.5mm/2.54mm spacing) This device is also useful as a general connection point to wire up your design to another part of your project. Our various solder wires solder well into these plated through hole pads. Hook-Up Wire - Assortment (Stranded, 22 AWG) <https://www.sparkfun.com/products/11375> (PRT-11375) Hook-Up Wire - Assortment (Solid Core, 22 AWG) <https://www.sparkfun.com/products/11367> (PRT-11367) View the entire wire category on our website here <https://www.sparkfun.com/categories/141> Special notes: Molex polarized connector foot print use with SKU : PRT-08231 with associated crimp pins and housings. 1MM SMD Version SKU: PRT-10208; PROD_ID: CONN-09696
J17 = SparkFun-Connectors:CONN_03: Multi connection point. Often used as Generic Header-pin footprint for 0.1 inch spaced/style header connections On any of the 0.1 inch spaced packages, you can populate with these: Break Away Headers - Straight <https://www.sparkfun.com/products/116> (PRT-00116) Break Away Male Headers - Right Angle <https://www.sparkfun.com/products/553> (PRT-00553) Female Headers <https://www.sparkfun.com/products/115> (PRT-00115) Break Away Headers - Machine Pin <https://www.sparkfun.com/products/117> (PRT-00117) Break Away Female Headers - Swiss Machine Pin <https://www.sparkfun.com/products/743> (PRT-00743) Stackable Header - 3 Pin (Female, 0.1") <https://www.sparkfun.com/products/13875> (PRT-13875) For SCREWTERMINALS and SPRING TERMINALS visit here: Screw Terimnals on SparkFun.com <https://www.sparkfun.com/search/results?term=Screw+Terminals> (5mm/3.5mm/2.54mm spacing) This device is also useful as a general connection point to wire up your design to another part of your project. Our various solder wires solder well into these plated through hole pads. Hook-Up Wire - Assortment (Stranded, 22 AWG) <https://www.sparkfun.com/products/11375> (PRT-11375) Hook-Up Wire - Assortment (Solid Core, 22 AWG) <https://www.sparkfun.com/products/11367> (PRT-11367) View the entire wire category on our website here <https://www.sparkfun.com/categories/141> Special notes: Molex polarized connector foot print use with SKU : PRT-08232 with associated crimp pins and housings.
L1 = _nanolabs_rcl:XAL6060; CURRENT: 5.8A; MPN: XAL6060-153MEC
L2 = _nanolabs_rcl:XAL6060; CURRENT: 8A; MPN: XAL6030-332MEC
L3 = _nanolabs_rcl:XAL6060; CURRENT: 10A; MPN: XAL6030-222MEC
LED1-LED3 = _nanolabs_diodes:LED0603
OK1-OK11 = _nanolabs_misc:TCMT1600
OLED1 = _nanolabs_misc:REX012864LWAP3N00000
Q1 = _nanolabs_transistors:CSD17308Q3
Q2 = transistor-fet:BSP170P: SIPMOS(R) Small-Signal-Transistor P-Channel, Enhancement mode Source: http://www.infineon.com/upload/Document/BSP170P_Rev2.4.pdf; URL: https://www2.mouser.com/ProductDetail/Diodes-Incorporated/ZXMP10A18GTA?qs=%2Fha2pyFadujeXLWCInqx8H5XBKM7VsRy4u%252BE5dUJDPjJ%2F5mXRIQ3Rw%3D%3D
R1 R5 R9 R88 R91 = _nanolabs_rcl:R0402; MPN: RC0402JR-130RL; PACKAGE: 0402
R2 R6 R10 R86 R87 R89 R90 = _nanolabs_rcl:R0402; MPN: AC0402FR-0739KL; PACKAGE: 0402
R3 R7 R11 R73 R78 = _nanolabs_rcl:R0402; MPN: AC0402FR-07100KL; PACKAGE: 0402
R4 R13-R15 R76 R77 = _nanolabs_rcl:R0402; MPN: RT0402DRE074K42L; PACKAGE: 0402
R8 = _nanolabs_rcl:R0402; MPN: RT0402FRE0724K9L; PACKAGE: 0402
R12 = _nanolabs_rcl:R0402; MPN: TNPW040243K7BEED; PACKAGE: 0402
R16 R18 R20 R22 R24 R26 R28 R30 R32 R34 R36 R40-R47 R50-R57 R60 R64 R68-R70 R75 R82-R85 = _nanolabs_rcl:R0402; MPN: AC0402FR-074K7L; PACKAGE: 0402
R17 R19 R21 R23 R25 R27 R29 R31 R33 R35 R37 R59 = _nanolabs_rcl:R-EU_: RESISTOR, European symbol; PACKAGE: 0603; SPICEPREFIX: R
R38 R39 R48 R49 = rcl:R-TRIMM: Trimm resistor; SPICEMODEL: X; SPICEPREFIXL: POT
R58 = _nanolabs_rcl:R0402; PACKAGE: 0402
R61-R63 R65 R66 R71 R72 R80 = _nanolabs_rcl:R0402; MPN: AC0402FR-071KL; PACKAGE: 0402
R67 R79 R81 = _nanolabs_rcl:R0402; MPN: AC0402FR-073K92L; PACKAGE: 0402
R74 = varistor:VARISTOR: VARISTOR; URL: https://www.tme.eu/ro/details/04701.25drsnp/sigurante-smd-1206-rapide/littelfuse/
S1 = switch-dil:219-04*: Surface Mount DIP Switch Series 219 SMT CTS Electronic Components Sourc: www.ctscorp.com; OC_FARNELL: unknown; OC_NEWARK: unknown
SJ1-SJ3 SJ5 = _nanolabs_misc:SJ2W
SJ4 SJ7-SJ10 = _nanolabs_misc:SJ
SW1 = switch-alps:EC12E_SW: ALPS rotary Encoder EC12E series with switch; MPN: EC12E2424407; OC_FARNELL: 1520813; OC_NEWARK: 74M1068
SW3 = SparkFun-Switches:MOMENTARY-SWITCH-SPST: Momentary Switch (Pushbutton) - SPST Normally-open (NO) SPST momentary switches (buttons, pushbuttons). Variants PTH-12MM - 12mm square, through-hole Momentary Pushbutton Switch - 12mm Square <https://www.sparkfun.com/products/9190> (COM-09190) PTH-6.0MM, PTH-6.0MM-KIT - 6.0mm square, through-hole Mini Pushbutton Switch <https://www.sparkfun.com/products/97> (COM-00097) KIT package intended for soldering kit's - only one side of pads' copper is exposed. PTH-RIGHT-ANGLE-KIT - Right-angle, through-hole Right Angle Tactile Button <https://www.sparkfun.com/products/10791> - Used on SparkFun BigTime Watch Kit <https://www.sparkfun.com/products/11734> SMD-12MM - 12mm square, surface-mount Tactile Button - SMD (12mm) <https://www.sparkfun.com/products/12993> (COM-12993) Used on SparkFun PicoBoard <https://www.sparkfun.com/products/11888> SMD-4.5MM - 4.5mm Square Trackball Switch Used on SparkFun Blackberry Trackballer Breakout <https://www.sparkfun.com/products/13169> SMD-4.6MMX2.8MM - 4.60mm x 2.80mm, surface mount Used on SparkFun SAMD21 Mini Breakout <https://www.sparkfun.com/products/13664> SMD-5.2MM, SMD-5.2-REDUNDANT - 5.2mm square, surface-mount Mini Pushbutton Switch - SMD <https://www.sparkfun.com/products/8720> (COM-08720) Used on Arduino Pro Mini <https://www.sparkfun.com/products/11114> REDUNDANT package connects both switch circuits together SMD-6.0X3.5MM - 6.0 x 3.5mm, surface mount Momentary Reset Switch SMD <https://www.sparkfun.com/products/8229> (COM-08229) SMD-6.2MM-TALL - 6.2mm square, surface mount Tactile Button - SMD (6mm) <https://www.sparkfun.com/products/12992> Used on SparkFun Digital Sandbox <https://www.sparkfun.com/products/12651> SMD-RIGHT-ANGLE - Right-angle, surface mount Used on SparkFun Block for Intel® Edison - Arduino <https://www.sparkfun.com/products/13036>; DESC: TACTILE SWITCH 6X6MM 13MM; LINK: https://www.tme.eu/ro/en/details/tactm-613n-f/microswitches-tact/ninigi/; MPN: TACTM-613N-F; PROD_ID: SWCH-11966; SF_SKU: COM-12992
TP1 TP2 = _nanolabs_misc:TP: Test pad
U1 = _nanolabs_modules:TEENSY4.1
U2 U3 = Texas Instruments_By_element14_Batch_1:TLV3502AQDCNRQ1: 4.5-ns RAIL-TO-RAIL HIGH-SPEED COMPARATOR; MPN: TLV3502AQDCNRQ1; OC_FARNELL: -; OC_NEWARK: 69R0419; PACKAGE: SOT23-8; SUPPLIER: Texas Instruments
X1 X2 = con-JST PH:S3B-PH: JST PH series header 2.00mm pitch disconnectable crimp style connectors, horizontal (side entry type), 3 pins
X3 = con-JST PH:S2B-PH: JST PH series header 2.00mm pitch disconnectable crimp style connectors, horizontal (side entry type), 2 pins

## Net classes
1 100R_DIFF: width 0.254 mm, drill 0.3 mm, clearance 0.254 mm